# Altium project TVS_Breakout_Brd.PrjPcb
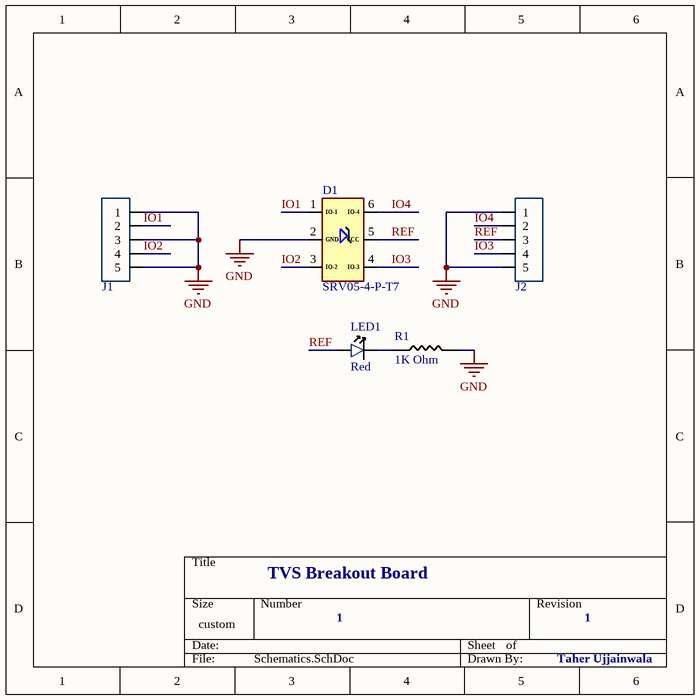
[diagram p0: Schematics.SchDoc]
1 sheet, 5 parts. Net scope: global (net labels, ports and power ports of the same name join across sheets).
Board file: TVS_Layout.PcbDoc

## Sheet Schematics.SchDoc
size 127 x 127 mm; SheetNumber: 1; SheetTotal: 1

### Parts
D1  SRV05-4-P-T7  [TVS]
J1  J_5_PIN_HEADER  [5_PIN_100MIL]  (value not drawn)
J2  J_5_PIN_HEADER  [5_PIN_100MIL]  (value not drawn)
LED1  value Red  [LED_0603]  (hidden comment: 0603R)
R1  value 1K Ohm  [0402_Passive_Resistor]  (hidden comment: 1k)

### Nets
GND: D1.2(GND) J1.1 J1.3 J1.5 J2.1 J2.5 R1.2
IO1: D1.1(IO-1) J1.2
IO2: D1.3(IO-2) J1.4
IO3: D1.4(IO-3) J2.4
IO4: D1.6(IO-4) J2.2
REF: D1.5(VCC) J2.3 LED1.1
NetLED1_2: LED1.2 R1.1

### Notes on the sheet
- TVS Breakout Board
- 1
- Taher Ujjainwala

### Library data of the parts
D1 = D_TVS_Diode: TVS SOT-23-6 ROHS; Value: TVS DIODE 5.5V 6TSOP; Type: Basic; MFR Part #: SRV05-4-P-T7; LCSC Part#: C85364; Datasheet: https://datasheet.lcsc.com/szlcsc/ProTek-Devices-SRV05-4-P-T7_C85364.pdf
J1 J2 = J_5_PIN_HEADER: 5 Position Header Connector 0.100" (2.54mm) Through Hole Tin
LED1 = LED_RED_0603: LIGHT EMITTING DIODES (LED) RED 520~625NM 90~100MCD@20MA TOP VIEW 0603 ROHS; MFR Part #: KT-0603R; Type: Basic; Datasheet: https://datasheet.lcsc.com/szlcsc/Everlight-Elec-19-217-BHC-ZL1M2RY-3T_C72041.pdf; LCSC Part#: C2286
R1 = R_1K_0402: 1 kOhms chip resistor SURFACE MOUNT 1KOHMS ±1% 1/16W 0402 ROHS; MFR Part #: 0402WGF1001TCE; Datasheet: https://datasheet.lcsc.com/szlcsc/Uniroyal-Elec-0402WGF1001TCE_C11702.pdf; LCSC Part#: C11702; Type: Basic